# Altium project solarInterface.PrjPcb
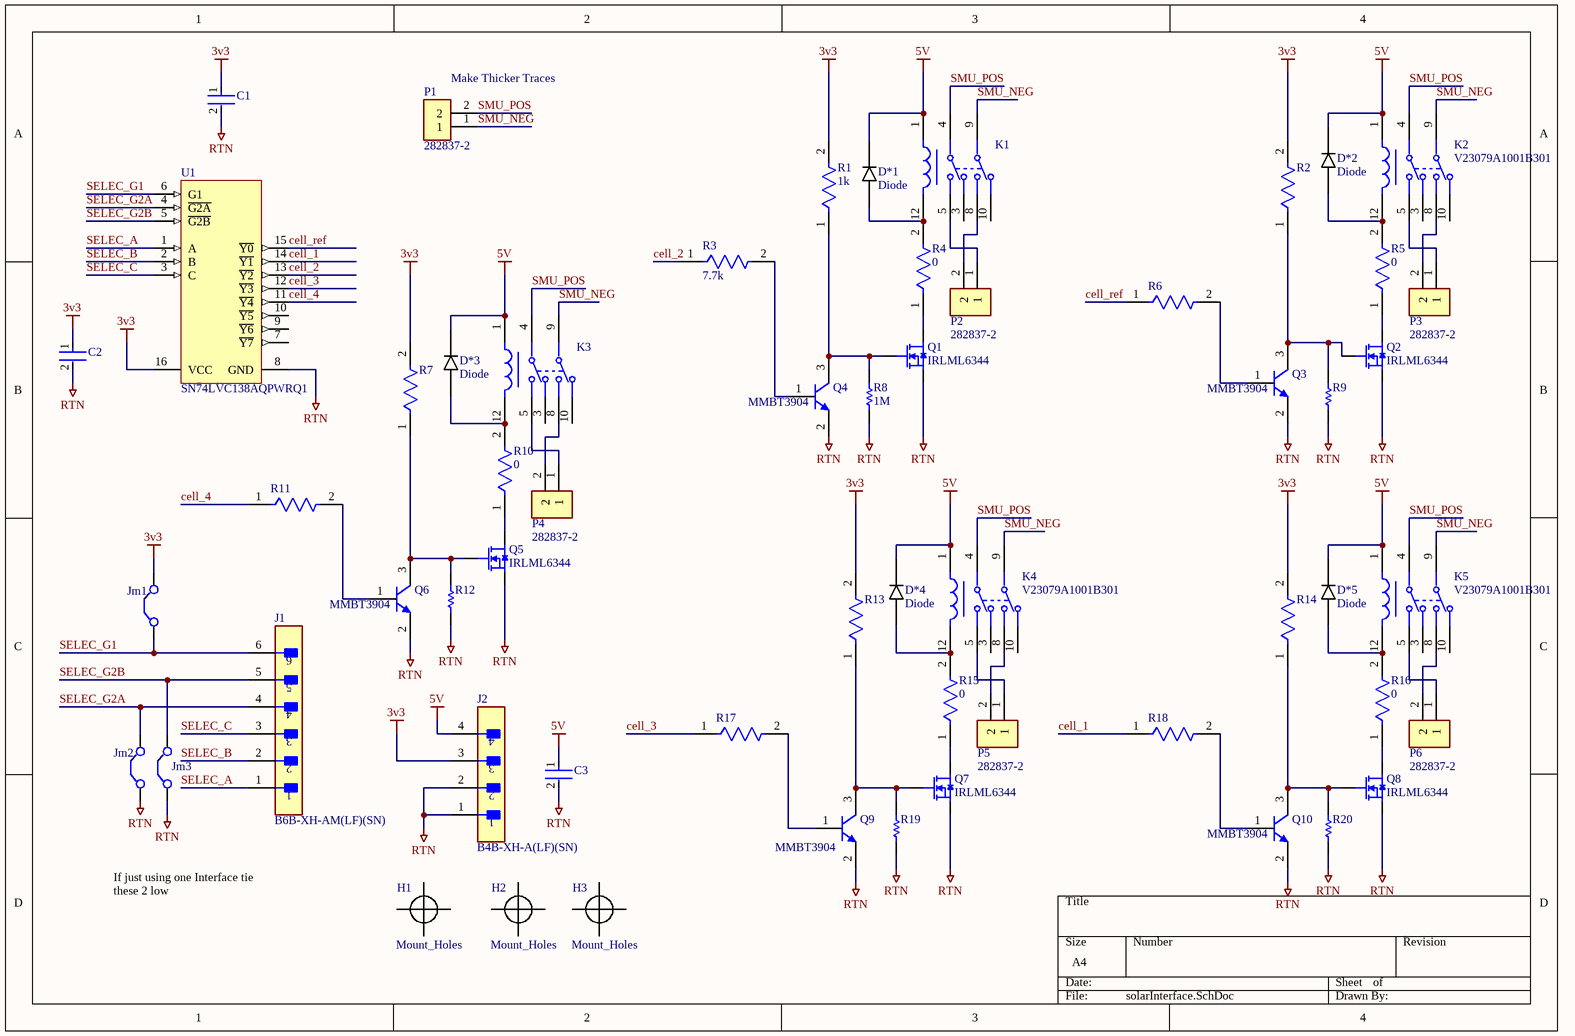
[diagram p0: solarInterface.SchDoc]
1 sheet, 58 parts. Net scope: global (net labels, ports and power ports of the same name join across sheets).
Board file: solarInterface.PcbDoc

## Sheet solarInterface.SchDoc
size A4; SheetNumber: 1; SheetTotal: 1

### Parts
C1  C2012X5R1A336M125AC  [FP-C2012-125-0_2-IPC_A]  (value not drawn)
C2  C0603X104K5RACTU  [FP-C0603-CJ-MFG]  (value not drawn)
C3  GRM188R71C474KA88D  [FP-GRM188-0_1-e0_2_0_5-IPC_A]  (value not drawn)
D*1  Diode  [DIOM6959X26M]
D*2  Diode  [DIOM6959X26M]
D*3  Diode  [DIOM6959X26M]
D*4  Diode  [DIOM6959X26M]
D*5  Diode  [DIOM6959X26M]
H1  Mount_Holes  [MountHole-4-40PTH]
H2  Mount_Holes  [MountHole-4-40PTH]
H3  Mount_Holes  [MountHole-4-40PTH]
J1  B6B-XH-AM(LF)(SN)  [FP-B6B-XH-AM_LF_SN-MFG]
J2  B4B-XH-A(LF)(SN)  [FP-B4B-XH-A_LF_SN-MFG]
Jm1  SolderJumper  [bridge]  (value not drawn)
Jm2  SolderJumper  [bridge]  (value not drawn)
Jm3  SolderJumper  [bridge]  (value not drawn)
K1  V23079A1001B301  [FP-V23079A1001B301-MFG]  (value not drawn)
K2  V23079A1001B301  [FP-V23079A1001B301-MFG]
K3  V23079A1001B301  [FP-V23079A1001B301-MFG]  (value not drawn)
K4  V23079A1001B301  [FP-V23079A1001B301-MFG]
K5  V23079A1001B301  [FP-V23079A1001B301-MFG]
P1  282837-2  [TE_282837-2]
P2  282837-2  [TE_282837-2]
P3  282837-2  [TE_282837-2]
P4  282837-2  [TE_282837-2]
P5  282837-2  [TE_282837-2]
P6  282837-2  [TE_282837-2]
Q1  IRLML6344  [SOT95P245X110-3N]
Q2  IRLML6344  [SOT95P245X110-3N]
Q3  MMBT3904  [FAIR-SOT23-3_V]
Q4  MMBT3904  [FAIR-SOT23-3_V]
Q5  IRLML6344  [SOT95P245X110-3N]
Q6  MMBT3904  [FAIR-SOT23-3_V]
Q7  IRLML6344  [SOT95P245X110-3N]
Q8  IRLML6344  [SOT95P245X110-3N]
Q9  MMBT3904  [FAIR-SOT23-3_V]
Q10  MMBT3904  [FAIR-SOT23-3_V]
R1  1k  [FP-RC0603-0_55-IPC_B]
R2  RC0603FR-071KL  [FP-RC0603-0_55-IPC_B]  (value not drawn)
R3  7.7k  [FP-RC0603-0_55-IPC_A]
R4  0  [FP-RC0603-0_55-IPC_B]
R5  0  [FP-RC0603-0_55-IPC_B]
R6  RC0603FR-0710KL  [FP-RC0603-0_55-IPC_A]  (value not drawn)
R7  RC0603FR-071KL  [FP-RC0603-0_55-IPC_B]  (value not drawn)
R8  1M  [RESC1608X55X25ML10T15]
R9  RC0603FR-071ML  [RESC1608X55X25ML10T15]  (value not drawn)
R10  0  [FP-RC0603-0_55-IPC_B]
R11  RC0603FR-0710KL  [FP-RC0603-0_55-IPC_A]  (value not drawn)
R12  RC0603FR-071ML  [RESC1608X55X25ML10T15]  (value not drawn)
R13  RC0603FR-071KL  [FP-RC0603-0_55-IPC_B]  (value not drawn)
R14  RC0603FR-071KL  [FP-RC0603-0_55-IPC_B]  (value not drawn)
R15  0  [FP-RC0603-0_55-IPC_B]
R16  0  [FP-RC0603-0_55-IPC_B]
R17  RC0603FR-0710KL  [FP-RC0603-0_55-IPC_A]  (value not drawn)
R18  RC0603FR-0710KL  [FP-RC0603-0_55-IPC_A]  (value not drawn)
R19  RC0603FR-071ML  [RESC1608X55X25ML10T15]  (value not drawn)
R20  RC0603FR-071ML  [RESC1608X55X25ML10T15]  (value not drawn)
U1  SN74LVC138AQPWRQ1  [PW0016A_M]

### Nets
3v3: C1.1 C2.1 J2.3 Jm1.2(C2) R1.2 R2.2 R7.2 R13.2 R14.2 U1.16(VCC)
5V: C3.1 D*1.CAT D*2.CAT D*3.CAT D*4.CAT D*5.CAT J2.4 K1.1 K2.1 K3.1 K4.1 K5.1
RTN: C1.2 C2.2 C3.2 J2.1 J2.2 Jm2.1(C1) Jm3.1(C1) Q1.2(S) Q2.2(S) Q3.2(E) Q4.2(E) Q5.2(S) Q6.2(E) Q7.2(S) Q8.2(S) Q9.2(E) Q10.2(E) R8.1 R9.1 R12.1 R19.1 R20.1 U1.8(GND)
cell_1: R18.1 U1.14(~{Y1})
cell_2: R3.1 U1.13(~{Y2})
cell_3: R17.1 U1.12(~{Y3})
cell_4: R11.1 U1.11(~{Y4})
cell_ref: R6.1 U1.15(~{Y0})
SELEC_A: J1.1 U1.1(A)
SELEC_B: J1.2 U1.2(B)
SELEC_C: J1.3 U1.3(C)
SELEC_G1: J1.6 Jm1.1(C1) U1.6(G1)
SELEC_G2A: J1.4 Jm2.2(C2) U1.4(~{G2A})
SELEC_G2B: J1.5 Jm3.2(C2) U1.5(~{G2B})
SMU_NEG: K1.9 K2.9 K3.9 K4.9 K5.9 P1.1
SMU_POS: K1.4 K2.4 K3.4 K4.4 K5.4 P1.2
NetD*1_AN: D*1.AN K1.12 R4.2
NetD*2_AN: D*2.AN K2.12 R5.2
NetD*3_AN: D*3.AN K3.12 R10.2
NetD*4_AN: D*4.AN K4.12 R15.2
NetD*5_AN: D*5.AN K5.12 R16.2
NetK1_5: K1.5 P2.1
NetK1_8: K1.8 P2.2
NetK2_5: K2.5 P3.1
NetK2_8: K2.8 P3.2
NetK3_5: K3.5 P4.1
NetK3_8: K3.8 P4.2
NetK4_5: K4.5 P5.1
NetK4_8: K4.8 P5.2
NetK5_5: K5.5 P6.1
NetK5_8: K5.8 P6.2
NetQ1_1: Q1.1(G) Q4.3(C) R1.1 R8.2
NetQ1_3: Q1.3(D) R4.1
NetQ2_1: Q2.1(G) Q3.3(C) R2.1 R9.2
NetQ2_3: Q2.3(D) R5.1
NetQ3_1: Q3.1(B) R6.2
NetQ4_1: Q4.1(B) R3.2
NetQ5_1: Q5.1(G) Q6.3(C) R7.1 R12.2
NetQ5_3: Q5.3(D) R10.1
NetQ6_1: Q6.1(B) R11.2
NetQ7_1: Q7.1(G) Q9.3(C) R13.1 R19.2
NetQ7_3: Q7.3(D) R15.1
NetQ8_1: Q8.1(G) Q10.3(C) R14.1 R20.2
NetQ8_3: Q8.3(D) R16.1
NetQ9_1: Q9.1(B) R17.2
NetQ10_1: Q10.1(B) R18.2

Not connected (* = marked no-connect by the designer): H1 0; H2 0; H3 0; K1 3 10; K2 3 10; K3 3 10; K4 3 10; K5 3 10; U1 7(~{Y7}) 9(~{Y6}) 10(~{Y5})

### Notes on the sheet
- (near P1) Make Thicker Traces
- If just using one Interface tie these 2 low

### Library data of the parts
C1 = CMP-08246-002720-1: Multilayer Ceramic Capacitors 33μF ±20% 10V X5R SMD 0805; Capacitance: 33uF; Dielectric: X5R; Series: C; Packaging: Tape and Reel; Voltage Rating: 10V; Height: 1.25mm; Tolerance: 20%; Thickness: 0.057inch; Min Operating Temperature: -55°C; Max Operating Temperature: 85°C; Case Code (Imperial): 0805; Voltage Rating (DC): 10V; Case Code (Metric): 2012; Length: 2mm; REACH SVHC: No SVHC; Depth: 1.25mm; Package Quantity: 1; Dielectric Material: Ceramic; Lead Free: Lead Free; Case/Package: 0805; Termination: SMD/SMT; Resistor Type: Ceramic; RoHS Compliant: Yes; Width: 0.049inch; Weight: 0.000194oz; Mount: Surface Mount
C2 = CMP-2006-03300-2: CAP CER 0.1UF 50V X7R 0603; Manufacturer: Kemet; Capacitance: 100nF; Material: Ceramic; Tolerance: 10%; Value: 100nF; Temperature Coefficient: 15%; Temperature Range High: +125°C; Temperature Range Low: -55°C; Manufacturer Part Number: C0603X104K5RACTU; Voltage: 50V; ComponentLink2Description: Datasheet; RoHS: TRUE; ComponentLink2URL: https://content.kemet.com/datasheets/KEM_C1013_X7R_FT-CAP_SMD.pdf; Device Class L3: Ceramic Capacitors; Device Class L2: Capacitors; Package: C0603-CJ; Height: 0.95mm; Device Class L1: Passive Components; Temperature Characteristic: X7R; Lead Free: Yes; Digikey Description: CAP CER 0.1UF 50V X7R 0603; Automotive: No; Mouser Description: Capacitor; Ceramic; Cap 0.1uF; Tol+10%; SMT; Flexible Termination; Vol-Rtg 50V; TR; Temperature: -55°C to +125°C; Octopart: https://octopart.com/c0603x104k5ractu-kemet-9145062; Category: Cap; Voltage Rating: 50V; Ipc Land Pattern Name: CAPC16080X80
C3 = CMP-2006-02860-2: Chip Multilayer Ceramic Capacitors for General Purpose, 0603, 0.47uF, X7R, 15%, 10%, 16V; Capacitance: 470nF; Material: Ceramic; Termination: SMD/SMT; Case Code (Imperial): 0603; Height: 0.8mm; Dielectric: X7R; Length: 1.6mm; Packaging: Tape and Reel; Mount: Surface Mount; Thickness: 0.035inch; Voltage Rating (DC): 16V; Case Code (Metric): 1608; REACH SVHC: No SVHC; Depth: 0.8mm; Number of Pins: 2; Max Operating Temperature: 125°C; Min Operating Temperature: -55°C; Width: 0.8mm; Voltage: 16V; Lead Free: Lead Free; Voltage Rating: 16V; Package Quantity: 1; Case/Package: 0603; Tolerance: 10%
D*1-D*5 = CMP-014-000000-1: Design Item ID: Diode; Source: SolarCar.SchLib; Pin Count: 2; Component Type: Standard
J1 = CMP-17439-000167-1: CONN HEADER VERT 6POS 2.5MM; Shape: Straight; Current Rating: 3A; Mated Stacking Heights: 9.8mm; Number of Positions: 6; Voltage Rating: 250V; Pitch: 2.5mm; Insulation Color: Natural; Number of Pins: 6; Width: 5.75mm; Flammability Rating: UL94 V-0; Packaging: Bulk; Connector Type: Header; Number of Rows: 1; Contact Plating: Copper; Mount: Through Hole; Min Operating Temperature: -25°C; Contact Type: Male Pin; Contact Shape: Square; Fastening Type: Detent; Length: 17.4mm; Series: XH; Contact Finish - Mating: TIN; Max Operating Temperature: 85°C; Insulation Material: Nylon; Number of Poles: 6; Termination: Press-Fit; Contact Material: Brass; Height: 7mm
J2 = CMP-17439-000250-1: CONN HEADER VERT 4POS 2.5MM; Number of Contacts: 4; Contact Resistance: 20mR; Voltage Rating: 250V; Max Current Rating: 3A; Gender: Male; Wire/Cable Gauge: 22AWG; Mated Stacking Heights: 9.8mm; Insulation Resistance: 1GR; Orientation: Straight; Contact Type: Male Pin; Contact Finish - Mating: TIN; Series: XH; Max Voltage Rating (AC): 250V; Lead Pitch: 2.5mm; Contact Shape: Square; Insulation Color: Natural; Termination: Solder; Lead Free: Lead Free; Voltage Rating (AC): 250V; Number of Rows: 1; Flammability Rating: UL94 V-0; Number of Positions: 4; Max Operating Temperature: 85°C; Package Quantity: 500; Mount: Through Hole; REACH SVHC: No SVHC; Connector Type: Header; Insulation Material: Nylon; Fastening Type: Detent; Min Operating Temperature: -25°C; Housing Color: White; Packaging: Bulk; Contact Plating: Tin; Contact Material: Brass; Max Voltage Rating (DC): 250V; Housing Material: Polyamide; Color: Natural; Material: Polyamide; Pitch: 2.5mm; Depth: 5.75mm; Current Rating: 3A; Length: 12.4mm
Jm1-Jm3 = SolderJumper: Solder Configuration Jumper; Published: 24-Mar-1999; LatestRevisionDate: 17-Jul-2002; LatestRevisionNote: Re-released for DXP Platform.; PackageReference: RAD-0.2; Publisher: Altium Limited; PackageDescription: Radial Cap, Thru-Hole; 2 Leads; 0.2 in Pin Spacing
K1-K5 = CMP-03396-000065-1: RELAY GEN PURPOSE DPDT 2A 5VDC; Manufacturer: TE Connectivity; Coil Voltage: 5V; Number Of Contacts: 2; Coil Power: 140mW; Switching Current: 5A; Coil Type: Non-Latching; Coil Resistance: 178Ω; Switching Power: 60W; Standoff Height: 0.4mm; Digikey Description: RELAY GEN PURPOSE DPDT 2A 5VDC; Mouser Description: Electromechanical Relay 5VDC 178Ohm 2A DPDT (( 14.5mm 7.2mm 9.8mm)) THT Signal Relay Automotive Medical; Package: V23079A1001B301; Current Rating: 2A; ComponentLink2Description: Datasheet; Lead Free: Yes; Manufacturer Part Number: V23079A1001B301; Ambient Temperature Range High: +85°C; Ambient Temperature Range Low: -40°C; Automotive: No; Device Class L3: Signal Relays; ComponentLink2URL: https://www.te.com/commerce/DocumentDelivery/DDEController?Action=showdoc&DocId=Specification+Or+Standard%7F108-98002%7FZ6%7Fpdf%7FEnglish%7FENG_SS_108-98002_Z6.pdf%7F1393788-3; Category: Relay; Device Class L2: Relays; Octopart: https://octopart.com/v23079a1001b301-te+connectivity-55433324; Throw Configuration: DPDT; Device Class L1: Electromechanical; Height: 9.9mm; RoHS: TRUE
P1-P6 = 282837-2: Ð Ð°Ð·ÑŠÐµÐ¼Ð½Ñ‹Ðµ ÐºÐ»ÐµÐ¼Ð¼Ð½Ñ‹Ðµ ÐºÐ¾Ð»Ð¾Ð´ÐºÐ¸ Ð Ð¾Ð·ÐµÑ‚ÐºÐ° 2 Ð¿Ð¾Ð»Ð¾Ð¶ÐµÐ½Ð¸Ñ 5,08 Ð¼Ð¼ ÐŸÑ€Ð¸Ð¿Ð¾Ð¹ Ð¿Ñ€ÑÐ¼Ð¾Ð¹ Ñ‡ÐµÑ€ÐµÐ· Ð¾Ñ‚Ð²ÐµÑ€ÑÑ‚Ð¸Ðµ 13,5 Ð / ÐºÐ¾Ð½Ñ‚Ð°ÐºÑ‚; MF: TE Connectivity; SnapEDA_Link: https://www.snapeda.com/parts/282837-2/TE+Connectivity+AMP+Connectors/view-part/?ref=snap; Price: None; Check_prices: https://www.snapeda.com/parts/282837-2/TE+Connectivity+AMP+Connectors/view-part/?ref=eda; Purchase-URL: https://pricing.snapeda.com/search/part/282837-2/?ref=eda; MP: 282837-2; Value: *; Availability: In Stock; Package: None
Q1 Q2 Q5 Q7 Q8 = CMP-006-0048-1: IRLML6344 N MOSFET 5.0A; Pin Count: 3; Source: SolarCar.SchLib; Component Type: Standard; Design Item ID: IRLML6344
Q3 Q4 Q6 Q9 Q10 = CMP-014-00026-1: NPN General Purpose Amplifier, 40 V, 0.2 A, -55 to 150 degC, 3-Pin SOT23, RoHS, Tape and Reel; Manufacturer: Fairchild Semiconductor; Package Version: Rev. 12, 03/2016; Power: 625mW; Elements: 1; Vce Max: 300mV; hFE Min: 100; Frequency: 300MHz; Max Operating Temperature: 150°C; Packaging: TapeandReel; Case/Package: TO-236-3; Package URL: http://www.fairchildsemi.com/dwg/MA/MA03D.pdf; Datasheet Version: Rev. 1.1.0, 10/2014; Package Description: 3-Pin Small Outline Transistor, Body 2.92 x 1.325 mm, Pitch 0.95 mm; Package Quantity: 3000; Datasheet URL: https://www.fairchildsemi.com/datasheets/MM/MMBT3904.pdf; Manufacturer URL: https://www.fairchildsemi.com/; RoHS Compliant: True; Mounting Technology: SM; Min Operating Temperature: -55°C; Pins: 3; Package Reference: SOT23-3
R1 = CMP-1659-00009-5: RES 1K OHM 1% 1/10W 0603 / RC0603FR-071KL; Resistance: 1kR; Voltage Rating: 50V; Power Rating: 100mW; Temperature Coefficient: 100ppm/°C; Military Standard: Not; REACH SVHC: No SVHC; Size Code: 0603; Features: Moisture Resistant; Number of Terminations: 2; Technology: THICK FILM; Series: RC; Case Code (Metric): 1608; Resistance Tolerance: 1%; Resistor Type: Thick Film; Termination: SMD/SMT; Contact Plating: Tin; Radiation Hardening: No; Min Operating Temperature: -55°C; Max Operating Temperature: 155°C; Packaging: Tape and Reel; Max Power Dissipation: 100mW; RoHS Compliant: Yes; Height: 0.45mm; Lead Free: Lead Free; Case/Package: 0603; Length: 1.6mm; Tolerance: 1%; Case Code (Imperial): 0603; Construction: Rectangular; Depth: 0.8mm
R2 R7 R13 R14 = CMP-1659-00009-5: RES 1K OHM 1% 1/10W 0603; Resistance: 1kR; Voltage Rating: 50V; Power Rating: 100mW; Temperature Coefficient: 100ppm/°C; Military Standard: Not; REACH SVHC: No SVHC; Size Code: 0603; Features: Moisture Resistant; Number of Terminations: 2; Technology: THICK FILM; Series: RC; Case Code (Metric): 1608; Resistance Tolerance: 1%; Resistor Type: Thick Film; Termination: SMD/SMT; Contact Plating: Tin; Radiation Hardening: No; Min Operating Temperature: -55°C; Max Operating Temperature: 155°C; Packaging: Tape and Reel; Max Power Dissipation: 100mW; RoHS Compliant: Yes; Height: 0.45mm; Lead Free: Lead Free; Case/Package: 0603; Length: 1.6mm; Tolerance: 1%; Case Code (Imperial): 0603; Construction: Rectangular; Depth: 0.8mm
R3 = CMP-2100-03664-2: RES 10K OHM 1% 1/10W 0603 / RC0603FR-0710KL; Voltage Rating: 75V; Voltage Rating (DC): 50V; Resistance: 10kR; Power Rating: 100mW; Temperature Coefficient: 100ppm/°C; Depth: 0.8mm; Termination: SMD/SMT; Resistor Type: Thick Film; Series: RC; Construction: Rectangular; Features: Moisture Resistant; Packaging: Tape and Reel; Min Operating Temperature: -55°C; Number of Terminations: 2; Lead Pitch: 0.3mm; RoHS Compliant: Yes; Case/Package: 0603; Resistance Tolerance: 1%; Military Standard: Not; Weight: 7.1E-05oz; Number of Pins: 2; Tolerance: 1%; Length: 1.6mm; Case Code (Imperial): 0603; Lead Free: Lead Free; Width: 0.8mm; Max Power Dissipation: 100mW; Height: 0.45mm; Max Operating Temperature: 155°C; Case Code (Metric): 1608; Size Code: 0603
R4 R5 R10 R15 R16 = CMP-1659-00009-5: 0 OHM 0603; Resistance: 1kR; Resistance Tolerance: 1%; Voltage Rating: 50V; Power Rating: 100mW; Temperature Coefficient: 100ppm/°C; Military Standard: Not; REACH SVHC: No SVHC; Size Code: 0603; Features: Moisture Resistant; Number of Terminations: 2; Technology: THICK FILM; Series: RC; Case Code (Metric): 1608; Resistor Type: Thick Film; Termination: SMD/SMT; Contact Plating: Tin; Radiation Hardening: No; Min Operating Temperature: -55°C; Max Operating Temperature: 155°C; Packaging: Tape and Reel; Max Power Dissipation: 100mW; RoHS Compliant: Yes; Height: 0.45mm; Lead Free: Lead Free; Case/Package: 0603; Length: 1.6mm; Tolerance: 1%; Case Code (Imperial): 0603; Construction: Rectangular; Depth: 0.8mm
R6 R11 R17 R18 = CMP-2100-03664-2: RES 10K OHM 1% 1/10W 0603; Voltage Rating: 75V; Voltage Rating (DC): 50V; Resistance: 10kR; Power Rating: 100mW; Temperature Coefficient: 100ppm/°C; Depth: 0.8mm; Termination: SMD/SMT; Resistor Type: Thick Film; Series: RC; Construction: Rectangular; Features: Moisture Resistant; Packaging: Tape and Reel; Min Operating Temperature: -55°C; Number of Terminations: 2; Lead Pitch: 0.3mm; RoHS Compliant: Yes; Case/Package: 0603; Resistance Tolerance: 1%; Military Standard: Not; Weight: 7.1E-05oz; Number of Pins: 2; Tolerance: 1%; Length: 1.6mm; Case Code (Imperial): 0603; Lead Free: Lead Free; Width: 0.8mm; Max Power Dissipation: 100mW; Height: 0.45mm; Max Operating Temperature: 155°C; Case Code (Metric): 1608; Size Code: 0603
R8 = CMP-1659-00056-1: Chip Resistor, 1 MOhm, +/- 1%, 100 mW, -55 to 155 degC, 0603 (1608 Metric), RoHS, Tape and Reel / RC0603FR-071ML; Voltage Rating (DC): 25 V; Tolerance: 20%; Case\Package: Radial; Capacitance: 1 mF; Min Operating Temperature: -40 degC; PackageDescription: 2-Pin Surface Mount Device, Body 1.6 x 0.8 mm; ComponentLink1Description: Manufacturer URL; Radiation Hardening: No; DatasheetVersion: Rev. 4, 02/2016; REACH SVHC: No SVHC; Length: 20 mm; Max Operating Temperature: 85 degC; Diameter: 10 mm; Packaging: Bulk; Package Quantity: 200; PackageReference: 0603; Mount: Through Hole; ComponentLink1URL: http://www.yageo.com/; ComponentLink2URL: http://www.yageo.com/documents/recent/PYu-RC_Group_51_RoHS_L_04.pdf; ComponentLink2Description: Datasheet; Width: 0 inch; Lead Pitch: 5 mm; RoHSCompliant: true; Voltage Rating: 25 V; Height: 20 mm
R9 R12 R19 R20 = CMP-1659-00056-1: Chip Resistor, 1 MOhm, +/- 1%, 100 mW, -55 to 155 degC, 0603 (1608 Metric), RoHS, Tape and Reel; Voltage Rating (DC): 25 V; Tolerance: 20%; Case\Package: Radial; Capacitance: 1 mF; Min Operating Temperature: -40 degC; PackageDescription: 2-Pin Surface Mount Device, Body 1.6 x 0.8 mm; ComponentLink1Description: Manufacturer URL; Radiation Hardening: No; DatasheetVersion: Rev. 4, 02/2016; REACH SVHC: No SVHC; Length: 20 mm; Max Operating Temperature: 85 degC; Diameter: 10 mm; Packaging: Bulk; Package Quantity: 200; PackageReference: 0603; Mount: Through Hole; ComponentLink1URL: http://www.yageo.com/; ComponentLink2URL: http://www.yageo.com/documents/recent/PYu-RC_Group_51_RoHS_L_04.pdf; ComponentLink2Description: Datasheet; Width: 0 inch; Lead Pitch: 5 mm; RoHSCompliant: true; Voltage Rating: 25 V; Height: 20 mm
U1 = CMP-1628-00027-2: Automotive Catalog 3-Line To 8-Line decoder/Demultiplexer, PW0016A, LARGE T&R; Manufacturer: Texas Instruments; Generic Part Number: SN74LVC138A-Q1; tpd @ Nom Voltage(Max)(ns): 7.9,6.7; Input Type: TLL/CMOS; F @ Nom Voltage(Max)(Mhz): 100; Channels(#): 1; VCC(Max)(V): 3.6; Schmitt Trigger: No; Output Drive (IOL/IOH)(Max)(mA): 24/-24; VCC(Min)(V): 2; Technology Family: LVC; Voltage(Nom)(V): 2.7,3.3; ICC @ Nom Voltage(Max)(mA): 0.01; Bits(#): 8; Output Type: CMOS; DatasheetVersion: SCAS708B; PackageReference: PW0016A; Operating Temperature Range(C): -40 to 125; Code_JEDEC: MO-153; Type: Standard; Rating: Automotive